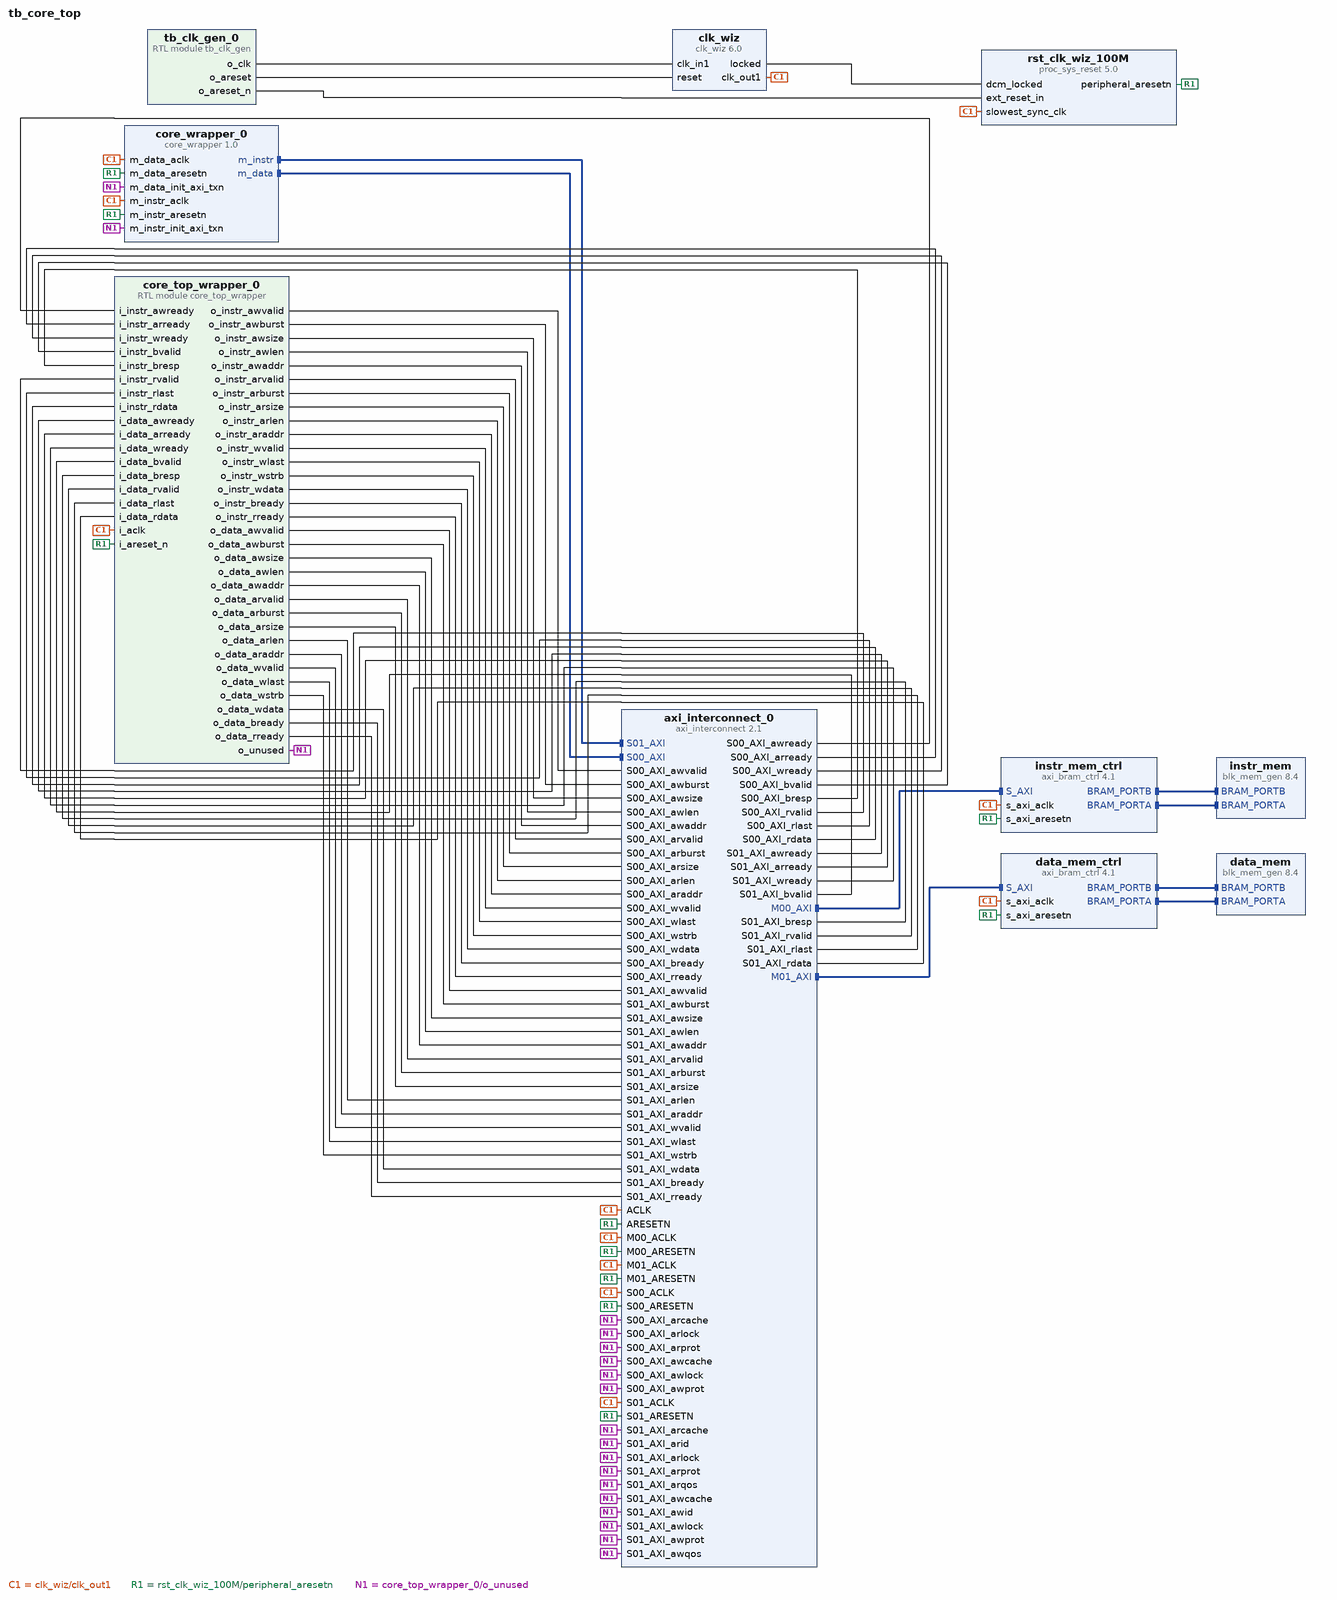
[diagram p0: block diagram of the top level]
# Vivado block design tb_core_top, xc7s50csga324-1, Vivado 2020.1
create_bd_design tb_core_top

create_bd_cell -type ip -vlnv xilinx.com:ip:proc_sys_reset:5.0 rst_clk_wiz_100M
create_bd_cell -type ip -vlnv xilinx.com:user:core_wrapper:1.0 core_wrapper_0
create_bd_cell -type module -reference tb_clk_gen tb_clk_gen_0
create_bd_cell -type module -reference core_top_wrapper core_top_wrapper_0
create_bd_cell -type ip -vlnv xilinx.com:ip:axi_bram_ctrl:4.1 instr_mem_ctrl
create_bd_cell -type ip -vlnv xilinx.com:ip:axi_bram_ctrl:4.1 data_mem_ctrl
create_bd_cell -type ip -vlnv xilinx.com:ip:axi_interconnect:2.1 axi_interconnect_0
set_property -dict {CONFIG.ENABLE_ADVANCED_OPTIONS 1 CONFIG.NUM_MI 2 CONFIG.NUM_SI 2} [get_bd_cells axi_interconnect_0]
create_bd_cell -type ip -vlnv xilinx.com:ip:blk_mem_gen:8.4 instr_mem
set_property -dict [list \
  CONFIG.Assume_Synchronous_Clk true \
  CONFIG.Coe_File ../../../../../../../test/asm/rv32i_compliance/rv32i_compliance.coe \
  CONFIG.Enable_B Use_ENB_Pin \
  CONFIG.Load_Init_File true \
  CONFIG.Memory_Type Dual_Port_ROM \
  CONFIG.Port_A_Write_Rate 0 \
  CONFIG.Port_B_Clock 100 \
  CONFIG.Port_B_Enable_Rate 100 \
  CONFIG.Use_RSTB_Pin true \
] [get_bd_cells instr_mem]
create_bd_cell -type ip -vlnv xilinx.com:ip:blk_mem_gen:8.4 data_mem
set_property -dict [list \
  CONFIG.Assume_Synchronous_Clk true \
  CONFIG.Enable_B Use_ENB_Pin \
  CONFIG.Memory_Type True_Dual_Port_RAM \
  CONFIG.Port_B_Clock 100 \
  CONFIG.Port_B_Enable_Rate 100 \
  CONFIG.Port_B_Write_Rate 50 \
  CONFIG.Use_RSTB_Pin true \
] [get_bd_cells data_mem]
create_bd_cell -type ip -vlnv xilinx.com:ip:clk_wiz:6.0 clk_wiz

# ---- connections ----

connect_bd_intf_net [get_bd_intf_pins data_mem/BRAM_PORTB] [get_bd_intf_pins data_mem_ctrl/BRAM_PORTB]
connect_bd_intf_net -intf_net axi_bram_ctrl_0_BRAM_PORTB [get_bd_intf_pins instr_mem/BRAM_PORTB] [get_bd_intf_pins instr_mem_ctrl/BRAM_PORTB]
connect_bd_intf_net [get_bd_intf_pins core_wrapper_0/m_instr] [get_bd_intf_pins axi_interconnect_0/S01_AXI]
connect_bd_intf_net -intf_net axi_bram_ctrl_0_BRAM_PORTA [get_bd_intf_pins instr_mem/BRAM_PORTA] [get_bd_intf_pins instr_mem_ctrl/BRAM_PORTA]
connect_bd_intf_net [get_bd_intf_pins data_mem/BRAM_PORTA] [get_bd_intf_pins data_mem_ctrl/BRAM_PORTA]
connect_bd_intf_net [get_bd_intf_pins axi_interconnect_0/M01_AXI] [get_bd_intf_pins data_mem_ctrl/S_AXI]
connect_bd_intf_net [get_bd_intf_pins axi_interconnect_0/M00_AXI] [get_bd_intf_pins instr_mem_ctrl/S_AXI]
connect_bd_intf_net [get_bd_intf_pins core_wrapper_0/m_data] [get_bd_intf_pins axi_interconnect_0/S00_AXI]
connect_bd_net [get_bd_pins clk_wiz/clk_out1] \
  [get_bd_pins rst_clk_wiz_100M/slowest_sync_clk] [get_bd_pins core_wrapper_0/m_data_aclk] \
  [get_bd_pins core_wrapper_0/m_instr_aclk] [get_bd_pins core_top_wrapper_0/i_aclk] [get_bd_pins instr_mem_ctrl/s_axi_aclk] \
  [get_bd_pins data_mem_ctrl/s_axi_aclk] [get_bd_pins axi_interconnect_0/ACLK] [get_bd_pins axi_interconnect_0/S00_ACLK] \
  [get_bd_pins axi_interconnect_0/M00_ACLK] [get_bd_pins axi_interconnect_0/S01_ACLK] \
  [get_bd_pins axi_interconnect_0/M01_ACLK]
connect_bd_net [get_bd_pins clk_wiz/locked] [get_bd_pins rst_clk_wiz_100M/dcm_locked]
connect_bd_net [get_bd_pins rst_clk_wiz_100M/peripheral_aresetn] \
  [get_bd_pins core_wrapper_0/m_data_aresetn] [get_bd_pins core_wrapper_0/m_instr_aresetn] \
  [get_bd_pins core_top_wrapper_0/i_areset_n] [get_bd_pins instr_mem_ctrl/s_axi_aresetn] \
  [get_bd_pins data_mem_ctrl/s_axi_aresetn] [get_bd_pins axi_interconnect_0/ARESETN] \
  [get_bd_pins axi_interconnect_0/S00_ARESETN] [get_bd_pins axi_interconnect_0/M00_ARESETN] \
  [get_bd_pins axi_interconnect_0/S01_ARESETN] [get_bd_pins axi_interconnect_0/M01_ARESETN]
connect_bd_net [get_bd_pins tb_clk_gen_0/o_clk] [get_bd_pins clk_wiz/clk_in1]
connect_bd_net [get_bd_pins tb_clk_gen_0/o_areset] [get_bd_pins clk_wiz/reset]
connect_bd_net [get_bd_pins tb_clk_gen_0/o_areset_n] [get_bd_pins rst_clk_wiz_100M/ext_reset_in]
connect_bd_net [get_bd_pins core_top_wrapper_0/o_instr_awvalid] [get_bd_pins axi_interconnect_0/S00_AXI_awvalid]
connect_bd_net [get_bd_pins core_top_wrapper_0/o_instr_awburst] [get_bd_pins axi_interconnect_0/S00_AXI_awburst]
connect_bd_net -net S00_AXI_awsize_1 [get_bd_pins core_top_wrapper_0/o_instr_awsize] [get_bd_pins axi_interconnect_0/S00_AXI_awsize]
connect_bd_net [get_bd_pins core_top_wrapper_0/o_instr_awlen] [get_bd_pins axi_interconnect_0/S00_AXI_awlen]
connect_bd_net [get_bd_pins core_top_wrapper_0/o_instr_awaddr] [get_bd_pins axi_interconnect_0/S00_AXI_awaddr]
connect_bd_net [get_bd_pins core_top_wrapper_0/o_instr_arvalid] [get_bd_pins axi_interconnect_0/S00_AXI_arvalid]
connect_bd_net [get_bd_pins core_top_wrapper_0/o_instr_arburst] [get_bd_pins axi_interconnect_0/S00_AXI_arburst]
connect_bd_net [get_bd_pins core_top_wrapper_0/o_instr_arsize] [get_bd_pins axi_interconnect_0/S00_AXI_arsize]
connect_bd_net [get_bd_pins core_top_wrapper_0/o_instr_arlen] [get_bd_pins axi_interconnect_0/S00_AXI_arlen]
connect_bd_net [get_bd_pins core_top_wrapper_0/o_instr_araddr] [get_bd_pins axi_interconnect_0/S00_AXI_araddr]
connect_bd_net [get_bd_pins core_top_wrapper_0/o_instr_wvalid] [get_bd_pins axi_interconnect_0/S00_AXI_wvalid]
connect_bd_net [get_bd_pins core_top_wrapper_0/o_instr_wlast] [get_bd_pins axi_interconnect_0/S00_AXI_wlast]
connect_bd_net [get_bd_pins core_top_wrapper_0/o_instr_wstrb] [get_bd_pins axi_interconnect_0/S00_AXI_wstrb]
connect_bd_net [get_bd_pins core_top_wrapper_0/o_instr_wdata] [get_bd_pins axi_interconnect_0/S00_AXI_wdata]
connect_bd_net [get_bd_pins core_top_wrapper_0/o_instr_bready] [get_bd_pins axi_interconnect_0/S00_AXI_bready]
connect_bd_net [get_bd_pins core_top_wrapper_0/o_instr_rready] [get_bd_pins axi_interconnect_0/S00_AXI_rready]
connect_bd_net [get_bd_pins axi_interconnect_0/S00_AXI_awready] [get_bd_pins core_top_wrapper_0/i_instr_awready]
connect_bd_net [get_bd_pins axi_interconnect_0/S00_AXI_arready] [get_bd_pins core_top_wrapper_0/i_instr_arready]
connect_bd_net [get_bd_pins axi_interconnect_0/S00_AXI_wready] [get_bd_pins core_top_wrapper_0/i_instr_wready]
connect_bd_net [get_bd_pins axi_interconnect_0/S00_AXI_bvalid] [get_bd_pins core_top_wrapper_0/i_instr_bvalid]
connect_bd_net [get_bd_pins axi_interconnect_0/S00_AXI_bresp] [get_bd_pins core_top_wrapper_0/i_instr_bresp]
connect_bd_net [get_bd_pins axi_interconnect_0/S00_AXI_rvalid] [get_bd_pins core_top_wrapper_0/i_instr_rvalid]
connect_bd_net [get_bd_pins axi_interconnect_0/S00_AXI_rlast] [get_bd_pins core_top_wrapper_0/i_instr_rlast]
connect_bd_net [get_bd_pins axi_interconnect_0/S00_AXI_rdata] [get_bd_pins core_top_wrapper_0/i_instr_rdata]
connect_bd_net [get_bd_pins core_top_wrapper_0/o_data_awvalid] [get_bd_pins axi_interconnect_0/S01_AXI_awvalid]
connect_bd_net [get_bd_pins core_top_wrapper_0/o_data_awburst] [get_bd_pins axi_interconnect_0/S01_AXI_awburst]
connect_bd_net [get_bd_pins core_top_wrapper_0/o_data_awsize] [get_bd_pins axi_interconnect_0/S01_AXI_awsize]
connect_bd_net [get_bd_pins core_top_wrapper_0/o_data_awlen] [get_bd_pins axi_interconnect_0/S01_AXI_awlen]
connect_bd_net [get_bd_pins core_top_wrapper_0/o_data_awaddr] [get_bd_pins axi_interconnect_0/S01_AXI_awaddr]
connect_bd_net [get_bd_pins core_top_wrapper_0/o_data_arvalid] [get_bd_pins axi_interconnect_0/S01_AXI_arvalid]
connect_bd_net [get_bd_pins core_top_wrapper_0/o_data_arburst] [get_bd_pins axi_interconnect_0/S01_AXI_arburst]
connect_bd_net [get_bd_pins core_top_wrapper_0/o_data_arsize] [get_bd_pins axi_interconnect_0/S01_AXI_arsize]
connect_bd_net [get_bd_pins core_top_wrapper_0/o_data_arlen] [get_bd_pins axi_interconnect_0/S01_AXI_arlen]
connect_bd_net [get_bd_pins core_top_wrapper_0/o_data_araddr] [get_bd_pins axi_interconnect_0/S01_AXI_araddr]
connect_bd_net [get_bd_pins core_top_wrapper_0/o_data_wvalid] [get_bd_pins axi_interconnect_0/S01_AXI_wvalid]
connect_bd_net [get_bd_pins core_top_wrapper_0/o_data_wlast] [get_bd_pins axi_interconnect_0/S01_AXI_wlast]
connect_bd_net [get_bd_pins core_top_wrapper_0/o_data_wstrb] [get_bd_pins axi_interconnect_0/S01_AXI_wstrb]
connect_bd_net [get_bd_pins core_top_wrapper_0/o_data_wdata] [get_bd_pins axi_interconnect_0/S01_AXI_wdata]
connect_bd_net [get_bd_pins core_top_wrapper_0/o_data_bready] [get_bd_pins axi_interconnect_0/S01_AXI_bready]
connect_bd_net [get_bd_pins core_top_wrapper_0/o_data_rready] [get_bd_pins axi_interconnect_0/S01_AXI_rready]
connect_bd_net [get_bd_pins axi_interconnect_0/S01_AXI_awready] [get_bd_pins core_top_wrapper_0/i_data_awready]
connect_bd_net [get_bd_pins axi_interconnect_0/S01_AXI_arready] [get_bd_pins core_top_wrapper_0/i_data_arready]
connect_bd_net [get_bd_pins axi_interconnect_0/S01_AXI_wready] [get_bd_pins core_top_wrapper_0/i_data_wready]
connect_bd_net [get_bd_pins axi_interconnect_0/S01_AXI_bvalid] [get_bd_pins core_top_wrapper_0/i_data_bvalid]
connect_bd_net [get_bd_pins axi_interconnect_0/S01_AXI_bresp] [get_bd_pins core_top_wrapper_0/i_data_bresp]
connect_bd_net [get_bd_pins axi_interconnect_0/S01_AXI_rvalid] [get_bd_pins core_top_wrapper_0/i_data_rvalid]
connect_bd_net [get_bd_pins axi_interconnect_0/S01_AXI_rlast] [get_bd_pins core_top_wrapper_0/i_data_rlast]
connect_bd_net [get_bd_pins axi_interconnect_0/S01_AXI_rdata] [get_bd_pins core_top_wrapper_0/i_data_rdata]
connect_bd_net [get_bd_pins core_top_wrapper_0/o_unused] \
  [get_bd_pins core_wrapper_0/m_instr_init_axi_txn] [get_bd_pins core_wrapper_0/m_data_init_axi_txn] \
  [get_bd_pins axi_interconnect_0/S01_AXI_awid] [get_bd_pins axi_interconnect_0/S01_AXI_awlock] \
  [get_bd_pins axi_interconnect_0/S01_AXI_awcache] [get_bd_pins axi_interconnect_0/S01_AXI_awprot] \
  [get_bd_pins axi_interconnect_0/S01_AXI_awqos] [get_bd_pins axi_interconnect_0/S01_AXI_arid] \
  [get_bd_pins axi_interconnect_0/S01_AXI_arlock] [get_bd_pins axi_interconnect_0/S01_AXI_arcache] \
  [get_bd_pins axi_interconnect_0/S01_AXI_arprot] [get_bd_pins axi_interconnect_0/S01_AXI_arqos] \
  [get_bd_pins axi_interconnect_0/S00_AXI_awlock] [get_bd_pins axi_interconnect_0/S00_AXI_awcache] \
  [get_bd_pins axi_interconnect_0/S00_AXI_awprot] [get_bd_pins axi_interconnect_0/S00_AXI_arlock] \
  [get_bd_pins axi_interconnect_0/S00_AXI_arcache] [get_bd_pins axi_interconnect_0/S00_AXI_arprot]

# ---- address map ----
assign_bd_address -offset 0x00000000 -range 4K -target_address_space [get_bd_addr_spaces core_wrapper_0/m_data] [get_bd_addr_segs instr_mem_ctrl/S_AXI/Mem0]
assign_bd_address -offset 0x00100000 -range 64K -target_address_space [get_bd_addr_spaces core_wrapper_0/m_data] [get_bd_addr_segs data_mem_ctrl/S_AXI/Mem0]
assign_bd_address -offset 0x00000000 -range 4K -target_address_space [get_bd_addr_spaces core_wrapper_0/m_instr] [get_bd_addr_segs instr_mem_ctrl/S_AXI/Mem0]
assign_bd_address -offset 0x00100000 -range 64K -target_address_space [get_bd_addr_spaces core_wrapper_0/m_instr] [get_bd_addr_segs data_mem_ctrl/S_AXI/Mem0]

validate_bd_design
save_bd_design
